# EAGLE board MainBoard (EAGLE 8.6.0)
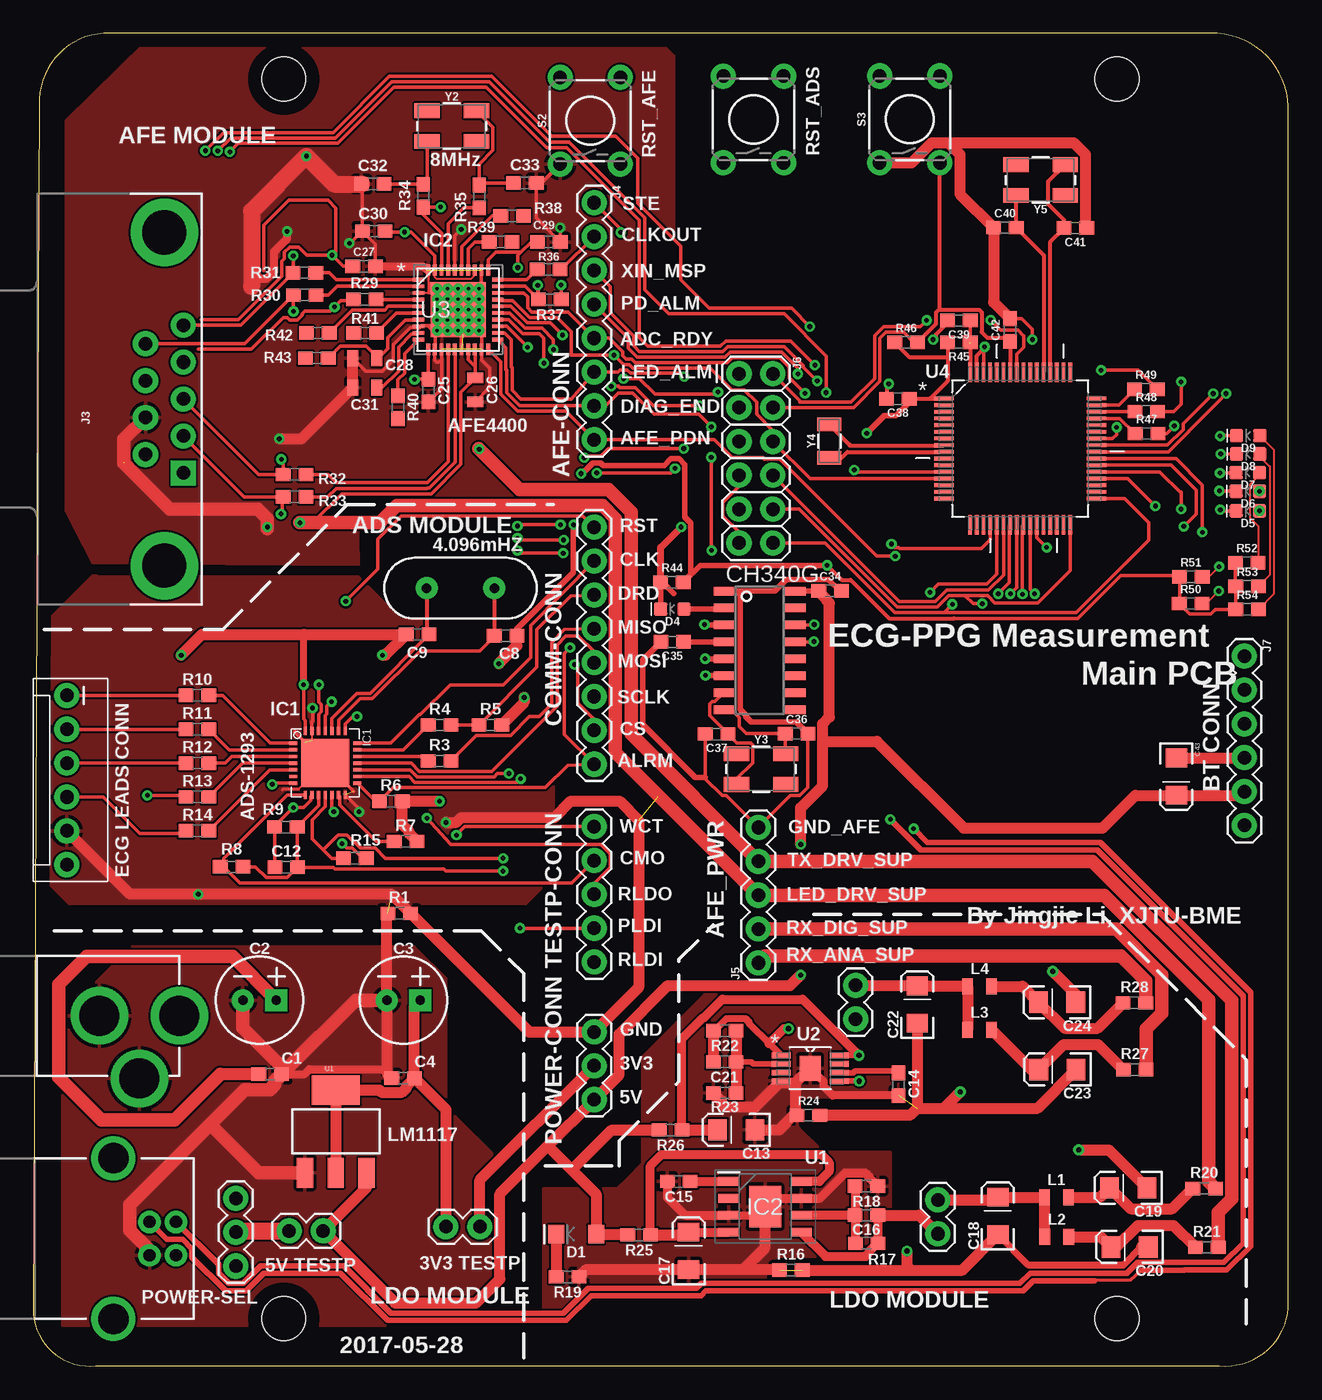
[diagram p2: board, top side]
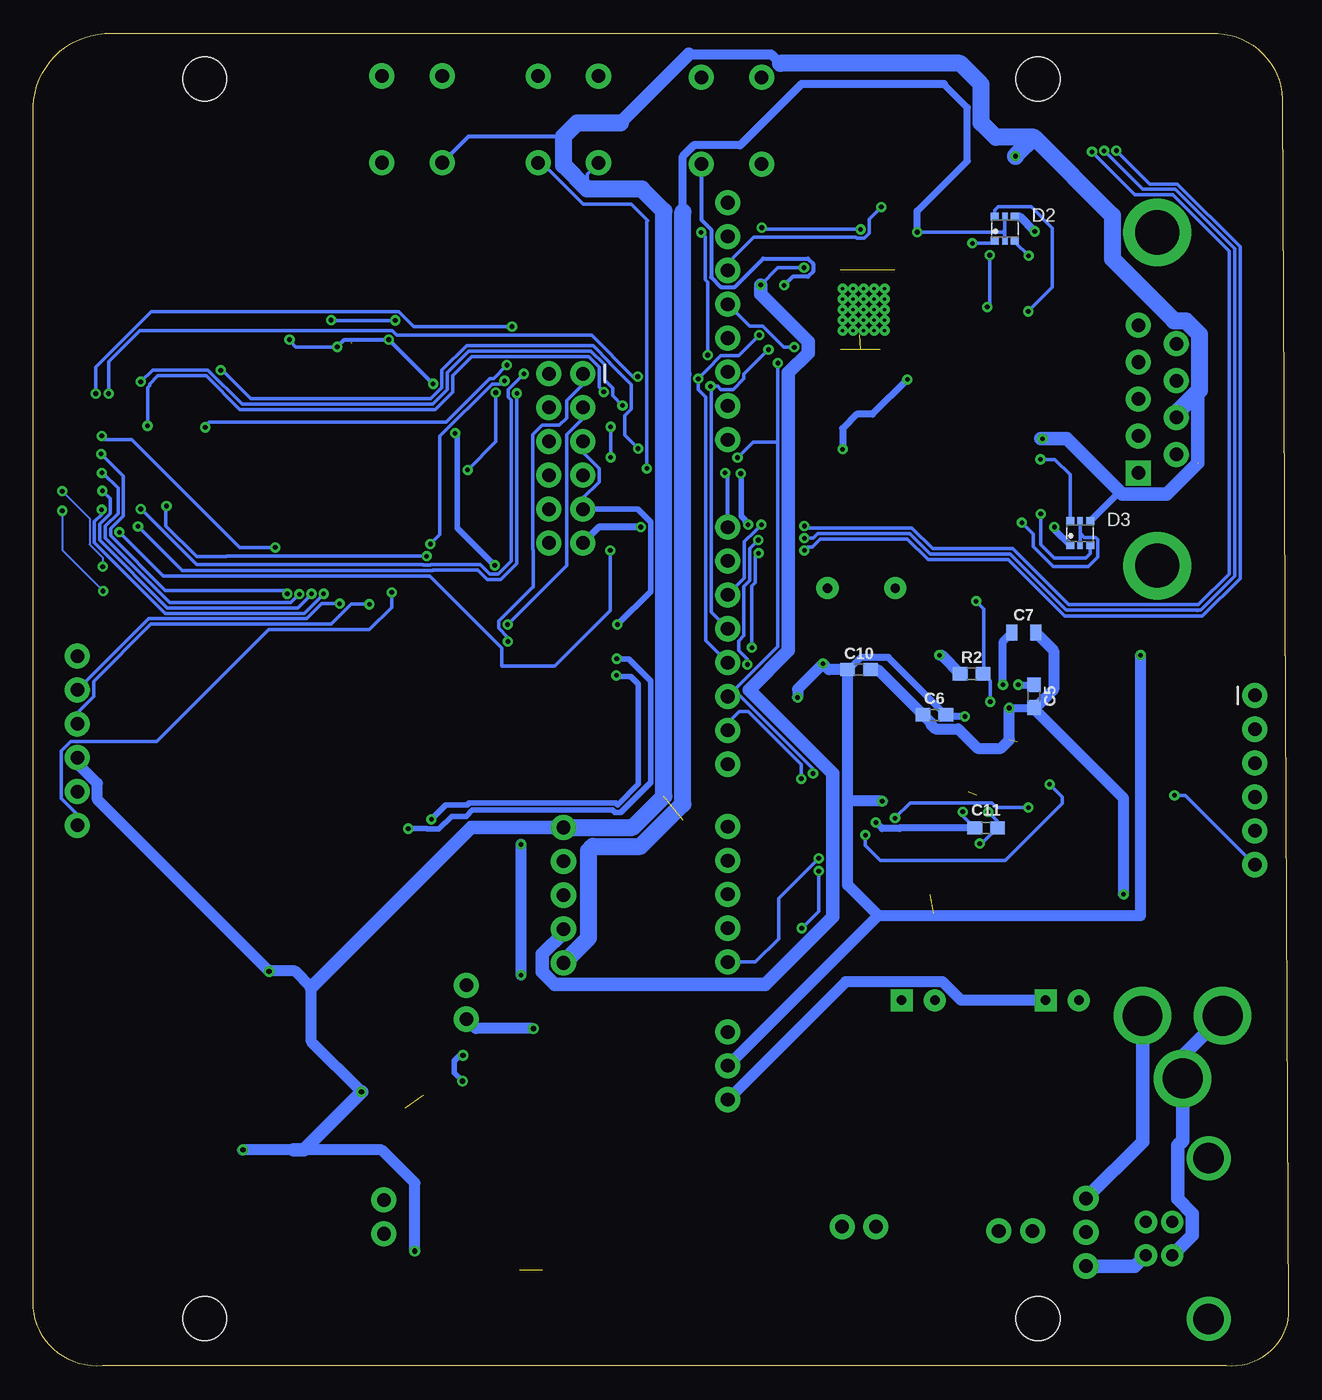
[diagram p3: board, bottom side, seen from below]

Size 94.11 x 99.97 mm. Coordinates in mm from the lower left corner, seen from the top.
Outline: 4.67,0.02 88.92,0.02 arc90 94.11,4.37 94.11,94.48 arc90 88.24,99.97 5.77,99.97 arc90 0.46,95.07 0,3.87 arc90 4.67,0.02
Copper layers (1*16): Top 0.035mm / dielectric 1.5mm / Bottom 0.035mm
Design rules "default": minimum track width 6mil, minimum drill 0.35mm, track to track 6mil, track to pad 6mil, pad to pad 6mil, via to via 6mil, smd to smd 6mil, copper to edge 40mil, drill to drill 6mil, minimum pad ring 10mil, minimum via ring 8mil, stop-mask expansion 4mil, vias tented up to drill 0mil, thermal gap 10mil

## Footprints (pad centres in the part's own frame; a part is rotated, then mirrored left to right if it is on the bottom)
1X02 = drill 1.016 pad 1.88: 1 0,0; 2 2.54,0
0603 = smd 1.1 x 1: 1 -0.85,0; 2 0.85,0
CPOL-RADIAL-2.5MM-6.5MM = drill 0.7 pad 1.651 square: 1 1.25,0 | drill 0.7 pad 1.651: 2 -1.25,0
0805 = smd 0.8 x 1.2: 1 -0.9,0; 2 0.9,0
EIA3216 = smd 1.4 x 1.6: A 1.4,0; C -1.4,0
1X08 = drill 1.016 pad 1.88: 1 0,0; 2 2.54,0; 3 5.08,0; 4 7.62,0; 5 10.16,0; 6 12.7,0; 7 15.24,0; 8 17.78,0
LED-1206 = smd 1.2 x 1.4: A -1.5,0; C 1.5,0
SOT363 = smd 0.6 x 0.6: 1 -0.75,-0.9; 3 0.75,-0.9; 4 0.75,0.9; 6 -0.75,0.9 | smd 0.4 x 0.6: 2 0,-0.9; 5 0,0.9
LED-0603 = smd 1 x 1: A -0.877,0; C 0.877,0
QFN28-5X5 = smd 0.25 x 0.6: 1 -1.5,-2.4; 2 -1,-2.4; 3 -0.5,-2.4; 4 0,-2.4; 5 0.5,-2.4; 6 1,-2.4; 7 1.5,-2.4; 15 1.5,2.4; 16 1,2.4; 17 0.5,2.4; 18 0,2.4; 19 -0.5,2.4; 20 -1,2.4; 21 -1.5,2.4 | smd 0.6 x 0.25: 8 2.4,-1.5; 9 2.4,-1; 10 2.4,-0.5; 11 2.4,0; 12 2.4,0.5; 13 2.4,1; 14 2.4,1.5; 22 -2.4,1.5; 23 -2.4,1; 24 -2.4,0.5; 25 -2.4,0; 26 -2.4,-0.5; 27 -2.4,-1; 28 -2.4,-1.5 | smd 3.6 x 3.6: GND 0,0
SOIC127P602X168-9N = smd 1.55 x 0.65: 1 -2.725,1.905; 2 -2.725,0.635; 3 -2.725,-0.635; 4 -2.725,-1.905; 5 2.725,-1.905; 6 2.725,-0.635; 7 2.725,0.635; 8 2.725,1.905 | smd 2.41 x 3.1: 9 0,0
POWER_JACK_PTH = drill 2.997 pad 4.318: GND 0,7.7; GNDBREAK 4.7,10.7; PWR 0,13.7
USB-B-PTH = drill 0.914 pad 1.676: D+ 4,1.25; D- 5.981,1.25; GND 4,-1.25; VBUS 5.981,-1.25 | drill 2.286: SHLD1 1.282,-6.02; SHLD2 1.282,6.02
DB9 = drill 1.016 pad 1.88 square: 1 -5.54,-1.42 | drill 1.016 pad 1.88: 2 -2.77,-1.42; 3 0,-1.42; 4 2.77,-1.42; 5 5.54,-1.42; 6 -4.15,1.42; 7 -1.38,1.42; 8 1.38,1.42; 9 4.15,1.42 | drill 3.302 pad 5.08: G1 -12.5,0; G2 12.5,0
1X05 = drill 1.016 pad 1.88: 1 0,0; 2 2.54,0; 3 5.08,0; 4 7.62,0; 5 10.16,0
2X6 = drill 1.016 pad 1.88: 1 0,0; 2 0,2.54; 3 2.54,0; 4 2.54,2.54; 5 5.08,0; 6 5.08,2.54; 7 7.62,0; 8 7.62,2.54; 9 10.16,0; 10 10.16,2.54; 11 12.7,0; 12 12.7,2.54
1X06 = drill 1.016 pad 1.88: 1 0,0; 2 2.54,0; 3 5.08,0; 4 7.62,0; 5 10.16,0; 6 12.7,0
1X03 = drill 1.016 pad 1.88: 1 0,0; 2 2.54,0; 3 5.08,0
TACTILE_SWITCH_PTH_6.0MM = drill 1.016 pad 1.88: 1 -3.251,2.261; 2 3.251,2.261; 3 -3.251,-2.261; 4 3.251,-2.261
MOLEX-1X6 = drill 1.016 pad 1.88: 1 0,0; 2 2.54,0; 3 5.08,0; 4 7.62,0; 5 10.16,0; 6 12.7,0
SOT223 = smd 1.219 x 2.235: 1 -2.311,-3.099; 2 0,-3.099; 3 2.311,-3.099 | smd 3.6 x 2.2: 4 0,3.099
SOP65P490X110-9N = smd 1.422 x 0.432: 1 -2.184,0.965; 2 -2.184,0.33; 3 -2.184,-0.33; 4 -2.184,-0.965; 5 2.184,-0.965; 6 2.184,-0.33; 7 2.184,0.33; 8 2.184,0.965 | smd 1.575 x 1.88: 9 0,0
RHA40_4P15X4P15 = smd 0.838 x 0.279: 1 -2.975,2.25; 2 -2.975,1.75; 3 -2.975,1.25; 4 -2.975,0.75; 5 -2.975,0.25; 6 -2.975,-0.25; 7 -2.975,-0.75; 8 -2.975,-1.25; 9 -2.975,-1.75; 10 -2.975,-2.25; 21 2.975,-2.25; 22 2.975,-1.75; 23 2.975,-1.25; 24 2.975,-0.75; 25 2.975,-0.25; 26 2.975,0.25; 27 2.975,0.75; 28 2.975,1.25; 29 2.975,1.75; 30 2.975,2.25 | smd 0.279 x 0.838: 11 -2.251,-2.975; 12 -1.75,-2.975; 13 -1.25,-2.975; 14 -0.75,-2.975; 15 -0.25,-2.975; 16 0.25,-2.975; 17 0.75,-2.975; 18 1.25,-2.975; 19 1.75,-2.975; 20 2.251,-2.975; 31 2.251,2.975; 32 1.75,2.975; 33 1.25,2.975; 34 0.75,2.975; 35 0.25,2.975; 36 -0.25,2.975; 37 -0.75,2.975; 38 -1.25,2.975; 39 -1.75,2.975; 40 -2.251,2.975 | smd 4.14 x 4.14: 41 0,0 | drill 0.254: V -1.575,-1.575; V_1 -1.575,-0.787; V_2 -1.575,0; V_3 -1.575,0.787; V_4 -1.575,1.575; V_5 -0.787,-1.575; V_6 -0.787,-0.787; V_7 -0.787,0; V_8 -0.787,0.787; V_9 -0.787,1.575; V_10 0,-1.575; V_11 0,-0.787; V_12 0,0; V_13 0,0.787; V_14 0,1.575; V_15 0.787,-1.575; V_16 0.787,-0.787; V_17 0.787,0; V_18 0.787,0.787; V_19 0.787,1.575; V_20 1.575,-1.575; V_21 1.575,-0.787; V_22 1.575,0; V_23 1.575,0.787; V_24 1.575,1.575
QFP50P1200X1200X120-64N = smd 1.473 x 0.279: 1 -5.715,3.759; 2 -5.715,3.251; 3 -5.715,2.743; 4 -5.715,2.261; 5 -5.715,1.753; 6 -5.715,1.245; 7 -5.715,0.762; 8 -5.715,0.254; 9 -5.715,-0.254; 10 -5.715,-0.762; 11 -5.715,-1.245; 12 -5.715,-1.753; 13 -5.715,-2.261; 14 -5.715,-2.743; 15 -5.715,-3.251; 16 -5.715,-3.759; 33 5.715,-3.759; 34 5.715,-3.251; 35 5.715,-2.743; 36 5.715,-2.261; 37 5.715,-1.753; 38 5.715,-1.245; 39 5.715,-0.762; 40 5.715,-0.254; 41 5.715,0.254; 42 5.715,0.762; 43 5.715,1.245; 44 5.715,1.753; 45 5.715,2.261; 46 5.715,2.743; 47 5.715,3.251; 48 5.715,3.759 | smd 0.279 x 1.473: 17 -3.759,-5.715; 18 -3.251,-5.715; 19 -2.743,-5.715; 20 -2.261,-5.715; 21 -1.753,-5.715; 22 -1.245,-5.715; 23 -0.762,-5.715; 24 -0.254,-5.715; 25 0.254,-5.715; 26 0.762,-5.715; 27 1.245,-5.715; 28 1.753,-5.715; 29 2.261,-5.715; 30 2.743,-5.715; 31 3.251,-5.715; 32 3.759,-5.715; 49 3.759,5.715; 50 3.251,5.715; 51 2.743,5.715; 52 2.261,5.715; 53 1.753,5.715; 54 1.245,5.715; 55 0.762,5.715; 56 0.254,5.715; 57 -0.254,5.715; 58 -0.762,5.715; 59 -1.245,5.715; 60 -1.753,5.715; 61 -2.261,5.715; 62 -2.743,5.715; 63 -3.251,5.715; 64 -3.759,5.715
STAND-OFF = hole 3.302: 0,0
SOIC16 = smd 0.635 x 1.524: 1 -4.445,-2.695; 2 -3.175,-2.695; 3 -1.905,-2.695; 4 -0.635,-2.695; 5 0.635,-2.695; 6 1.905,-2.695; 7 3.175,-2.695; 8 4.445,-2.695; 9 4.445,2.695; 10 3.175,2.695; 11 1.905,2.695; 12 0.635,2.695; 13 -0.635,2.695; 14 -1.905,2.695; 15 -3.175,2.695; 16 -4.445,2.695
HC49US = drill 0.7 pad 1.651: 1 -2.54,0; 2 2.54,0
CRYSTAL-SMD-5X3.2-4PAD = smd 1.9 x 1.1: 1 -1.85,-1.15; 2 1.85,-1.15; 3 1.85,1.15; 4 -1.85,1.15
CRYSTAL-SMD-3.2X1.5MM = smd 1 x 1.8: P$1 -1.25,0; P$2 1.25,0

## Placement (x,y rotation side)
3V3-POWER-TESTPOINT  [1X02]  33.47,10.47 180 top
3V3-POWER-TESTPOINT1  [1X02]  67.82,12.47 270 top
3V3-POWER-TESTPOINT2  [1X02]  61.65,28.57 270 top
5V-POWER-TESTPOINT  [1X02]  21.73,10.15 180 top
C1  0.1uF  [0603]  17.76,21.9 0 top
C2  100uF  [CPOL-RADIAL-2.5MM-6.5MM]  16.96,27.45 0 top
C3  100uF  [CPOL-RADIAL-2.5MM-6.5MM]  27.76,27.45 0 top
C4  0.1uF  [0603]  27.73,21.61 180 top
C5  0.1uF  [0603]  19.09,50.25 270 bottom
C6  0.1uF  [0603]  26.55,48.85 180 bottom
C7  1.0uF  [0805]  19.85,55.01 0 bottom
C8  22pF  [0603]  35.41,54.79 0 top
C9  22pF  [0603]  28.81,54.88 180 top
C10  0.1uF  [0603]  32.2,52.25 0 bottom
C11  0.1uF  [0603]  22.68,40.37 180 bottom
C12  1nF  [0603]  18.96,37.42 0 top
C13  10uF  [EIA3216]  52.71,17.72 180 top
C14  10nF  [0603]  64.87,21.15 270 top
C15  10nF  [0603]  48.39,13.86 180 top
C16  1nF  [0603]  62.46,11.32 180 top
C17  10uF  [EIA3216]  49.13,8.66 90 top
C18  10uF  [EIA3216]  72.32,11.27 90 top
C19  10uF  [EIA3216]  82.09,13.38 180 top
C20  10uF  [EIA3216]  82.2,8.94 180 top
C21  10nF  [0603]  51.84,22.83 0 top
C22  10uF  [EIA3216]  66.27,27.12 90 top
C23  10uF  [EIA3216]  76.79,22.25 180 top
C24  10uF  [EIA3216]  76.76,27.3 180 top
C25  0.1uF  [0603]  29.62,73.17 270 top
C26  1.0uF  [0805]  33.12,73.22 270 top
C27  10nF  [0603]  24.79,82.49 0 top
C28  2.2uF  [0805]  24.84,75.61 0 top
C29  0.1uF  [0603]  38.66,84.32 0 top
C30  0.1uF  [0603]  25.53,85.14 180 top
C31  2.2uF  [0805]  24.84,73.4 180 top
C32  18pF  [0603]  25.45,88.67 0 top
C33  18pF  [0603]  36.86,88.74 0 top
C34  0.1uF  [0603]  59.74,58.16 0 top
C35  0.1uF  [0603]  47.91,54.33 180 top
C36  22pF  [0603]  57.23,47.44 0 top
C37  22pF  [0603]  51.23,47.42 180 top
C38  0.1uF  [0603]  64.82,72.56 180 top
C39  1.0uF  [0603]  69.39,78.43 180 top
C40  30pF  [0603]  72.85,85.39 0 top
C41  30pF  [0603]  78.13,85.36 180 top
C42  0.1uF  [0603]  73.23,77.72 90 top
C43  10uF  [EIA3216]  85.7,44.22 270 top
COMM-CONN  [1X08]  42.05,62.93 270 top
D1  GREEN  [LED-1206]  40.69,9.9 180 top
D2  BAV99S  [SOT363]  21.26,85.31 0 bottom
D3  BAV99S  [SOT363]  15.62,62.48 0 bottom
D4  RED  [LED-0603]  47.91,56.79 180 top
D5  RED  [LED-0603]  91.06,64.16 180 top
D6  RED  [LED-0603]  91.06,65.63 180 top
D7  RED  [LED-0603]  91.06,67.03 180 top
D8  RED  [LED-0603]  91.09,68.42 180 top
D9  RED  [LED-0603]  91.09,69.79 180 top
IC1  ADS1293  [QFN28-5X5]  21.88,45.23 270 top
IC2  LP3878MR-ADJ_NOPB  [SOIC127P602X168-9N]  54.87,11.96 0 top
J1  POWER_JACK  [POWER_JACK_PTH]  -2.75,26.28 270 top
J2  USB_B_PTH  [USB-B-PTH]  4.71,9.57 0 top
J3  [DB9]  9.83,72.54 90 top
J4  [1X08]  42.05,87.27 270 top
J5  [1X05]  54.36,30.25 90 top
J6  2X6 FEMALE  [2X6]  52.91,74.44 270 top
J7  [1X06]  90.81,53.26 270 top
L1  3.3µH/±20%/450mA  [0805]  76.71,12.67 0 top
L2  3.3µH/±20%/450mA  [0805]  76.74,9.7 0 top
L3  3.3µH/±20%/450mA  [0805]  70.94,25.22 0 top
L4  3.3µH/±20%/450mA  [0805]  70.94,28.49 0 top
POWER-CONN  455-1750-1-ND  [1X03]  42.05,25.07 270 top
POWER-JUMPER  [1X03]  15.18,12.59 270 top
R1  0  [0603]  27.44,33.96 0 top
R2  1M  [0603]  23.76,51.93 180 bottom
R3  51  [0603]  30.46,45.39 0 top
R4  51  [0603]  30.46,48.09 0 top
R5  1M  [0603]  34.27,48.09 0 top
R6  1M  [0603]  26.81,42.37 0 top
R7  1M  [0603]  27.92,39.36 0 top
R8  10k  [0603]  14.87,37.45 180 top
R9  10M  [0603]  18.93,40.44 180 top
R10  0  [0603]  12.3,50.31 0 top
R11  0  [0603]  12.3,47.77 0 top
R12  0  [0603]  12.3,45.23 0 top
R13  0  [0603]  12.3,42.69 0 top
R14  0  [0603]  12.3,40.15 0 top
R15  0  [0603]  24.11,38.09 0 top
R16  0  [0603]  56.8,7.21 0 top
R17  2.55k  [0603]  62.49,9.22 0 top
R18  1k  [0603]  62.46,13.51 180 top
R19  4.7k  [0603]  40.06,6.7 180 top
R20  0  [0603]  87.78,13.33 0 top
R21  0  [0603]  87.99,8.91 0 top
R22  75k  [0603]  51.84,25.17 180 top
R23  47k  [0603]  51.84,20.49 0 top
R24  0  [0603]  58.12,18.82 0 top
R25  0  [0603]  45.42,9.85 180 top
R26  0  [0603]  47.78,17.72 180 top
R27  0  [0603]  82.58,22.25 0 top
R28  0  [0603]  82.55,27.25 0 top
R29  1k  [0603]  24.84,80 0 top
R30  0  [0603]  20.35,80.34 0 top
R31  0  [0603]  20.32,82.01 0 top
R32  0  [0603]  19.59,66.87 0 top
R33  0  [0603]  19.59,65.2 0 top
R34  0  [0603]  29.24,87.78 90 top
R35  0  [0603]  33.43,87.73 270 top
R36  10  [0603]  38.64,82.27 0 top
R37  10k  [0603]  38.74,80 180 top
R38  130  [0603]  35.89,86.28 0 top
R39  130  [0603]  35.03,84.32 0 top
R40  130  [0603]  27.33,71.93 270 top
R41  130  [0603]  24.87,77.49 180 top
R42  130  [0603]  21.34,77.49 180 top
R43  130  [0603]  21.26,75.61 180 top
R44  4.7k  [0603]  47.88,58.8 0 top
R45  1  [0603]  69.39,76.78 180 top
R46  10k  [0603]  65.43,76.78 0 top
R47  10  [0603]  83.47,69.95 0 top
R48  10  [0603]  83.44,71.6 0 top
R49  10  [0603]  83.42,73.27 0 top
R50  1k  [0603]  86.77,57.2 0 top
R51  1k  [0603]  86.79,59.2 0 top
R52  1k  [0603]  90.98,60.27 0 top
R53  1k  [0603]  91.01,58.49 0 top
R54  1k  [0603]  91.01,56.76 0 top
S1  MOMENTARY-SWITCH-SPST-PTH-6.0MM  [TACTILE_SWITCH_PTH_6.0MM]  54,93.51 90 top
S2  MOMENTARY-SWITCH-SPST-PTH-6.0MM  [TACTILE_SWITCH_PTH_6.0MM]  41.76,93.42 90 top
S3  MOMENTARY-SWITCH-SPST-PTH-6.0MM  [TACTILE_SWITCH_PTH_6.0MM]  65.71,93.52 90 top
SIGNAL-CONN  [MOLEX-1X6]  2.52,50.31 270 top
TEST-CONN  [1X05]  42.05,40.47 270 top
U1  [SOT223]  22.68,17.61 0 top
U2  TPS7A4901DGNR  [SOP65P490X110-9N]  58.24,22.35 0 top
U3  AFE4400_RHA_40  [RHA40_4P15X4P15]  31.85,79.24 0 top
U4  MSP430F149IPAG  [QFP50P1200X1200X120-64N]  73.99,68.83 0 top
U$1  [STAND-OFF]  81.26,3.58 0 top
U$2  [STAND-OFF]  81.26,96.54 0 top
U$3  [STAND-OFF]  18.77,96.54 0 top
U$4  [STAND-OFF]  18.77,3.58 0 top
U$5  CH340G  [SOIC16]  54.46,53.69 270 top
Y1  4.096MHz  [HC49US]  32.02,58.35 0 top
Y2  8MHz  [CRYSTAL-SMD-5X3.2-4PAD]  31.37,93.01 0 top
Y3  12MHz  [CRYSTAL-SMD-5X3.2-4PAD]  54.56,44.78 0 top
Y4  32.768kHz  [CRYSTAL-SMD-3.2X1.5MM]  59.69,69.39 90 top
Y5  8MHz  [CRYSTAL-SMD-5X3.2-4PAD]  75.52,88.97 180 top

## Tracks (layer width: path | path; a pad name or v marks a point on that pad's centre or on a via)
+3V3  (via drill 0.35, 0.35 pad 0.55)
  Top 0.254: IC1.28 20.38,48.42 20.26,48.53 v20.26,51.11 | IC1.22 23.38,48.16 23.95,48.73 v24.27,48.73 | R52.1 90.13,58.52 R53.1 R54.1 88.63,56.76 88.28,56.42 86.7,56.42 R50.1 85.94,57.22 R51.1 | 69.04,56.08 78.3,56.08 81.53,59.3 85.84,59.3
  Top 0.305: C38.1 65.7,72.59 67.24,72.59 | 67.24,72.59 U4.1 | R45.2 68.54,75.69 | 68.54,75.69 68.54,73.9 67.24,72.59 | 68.54,75.69 65.67,75.69 R46.1 | v59.51,60.07 60.61,58.97 61.27,58.97 64.16,56.08 69.04,56.08 | 85.84,59.3 R51.1
  Top 0.406: v41.07,66.95 41.15,66.95 41.94,67.73 42.55,67.73 42.72,67.56 47.3,67.56 47.81,68.06 48.41,68.06 48.84,67.63 48.84,63.69 49.3,63.24 49.3,59.36 R44.2 50,60.07 v59.51,60.07 | C8.2 36.26,55.3 40.49,59.53 40.49,63.09 v40.51,63.12 | v62.49,69.97 63.81,71.29 64.67,71.29 65.7,72.32 65.7,72.59
  Top 0.508: v20.26,51.11 20.26,54.85 20.3,54.88
  Top 0.813: 3V3-POWER-TESTPOINT.1 33.47,13.96 POWER-CONN.2 | v34.9,52.69 36.26,54.05 C8.2 | v36.81,50.15 36.81,49.78 R5.2 | v11.09,53.33 12.64,54.88 20.3,54.88 C9.2 26.4,53.33 v26.17,53.33 | R7.2 28.18,39.95 28.18,40.09 27.66,40.61 R6.2 v30.46,42.38
  Bottom 0.406: v40.51,63.12 40.75,63.35 40.75,63.47 41.04,63.76 41.04,66.92 v41.07,66.95 | v59.51,60.07 62.31,62.86 62.31,69.79 v62.49,69.97
  Bottom 0.508: v20.26,51.11 v20.26,51.1 C5.1 | v24.27,48.73 25.57,48.73 C6.1 30,53.16 32.07,53.16 32.98,52.25 C10.1
  Bottom 0.813: 24.54,52 R2.2 26,53.33 v26.17,53.33 | POWER-CONN.2 30.77,33.8 | 30.77,33.8 11.09,33.8 v11.09,53.33 | 30.77,33.8 33.05,36.08 33.05,42.38 | 33.05,42.38 C10.1 34.46,52.25 v34.9,52.69 36.81,50.79 v36.81,50.15 | v30.46,42.38 33.05,42.38
+5V  (via drill 0.35)
  Top 0.406: U$5.16 58.87,58.14 C34.1
  Top 0.61: 37.12,15.04 37.12,15.07
  Top 0.813: U1.3 24.99,13.41 5V-POWER-TESTPOINT.1 27.13,4.74 33.2,4.74 34.97,6.52 34.97,12.92 37.12,15.07 38.57,16.52 | 38.57,16.52 POWER-CONN.3 43.92,21.86 43.92,24.89 47.58,28.54 56.75,28.54 v57.53,29.33 | 38.57,16.52 40.38,14.71 | 40.38,14.71 42.19,12.9 D1.A 42.24,9.85 R25.2 | 40.38,14.71 43.39,17.72 R26.2 | v57.53,39.14 57.53,41.88 59.19,43.54 59.19,46.86 | 59.19,46.86 59.19,48.18 59.69,48.69 59.69,57.22 59.48,57.43 59.48,57.52 58.87,58.14 | J7.5 90.52,42.82 C43.A 82.63,42.82 80.16,40.36 69.75,40.36 63.25,46.86 59.19,46.86
  Top 0.889: C1.1 14,21.9
  Top 1.016: 14,21.9 10.59,18.49 5.08,18.49 1.91,21.66 1.91,28.62 4.02,30.73 14.94,30.73 C2.1
  Bottom 0.813: C2.1 24.55,27.45 25.93,28.84 33.2,28.84 POWER-CONN.3 | v57.53,29.33 v57.53,39.14
ADC_RDY  (via drill 0.35)
  Top 0.254: U3.28 36.78,80.49 37.06,80.21 37.06,79.39 37.38,79.07 40.09,79.07 J4.5 43.2,77.11 44.2,76.11 44.2,75.79 44.45,75.53 44.86,75.53 45.11,75.28 52.02,75.28 52.41,75.66 55.96,75.66 56.67,74.95 56.67,74.11 56.72,74.06 56.76,74.06 v57.86,72.97 | v86.26,62.99 87.2,63.93 87.2,65.7 85.32,67.58 U4.38
  Bottom 0.254: v57.86,72.97 57.86,65.66 57.86,65.65 57.86,60.21 59.08,59 60.06,59 60.77,59.71 64.16,59.71 64.18,59.69 82.96,59.69 v86.26,62.99
AFE_PDN  (via drill 0.35)
  Top 0.254: U3.20 35.03,75.34 35.03,72.9 36.31,71.62 39.91,71.62 J4.8 | J4.8 42.55,69.49 | J4.8 51.06,69.49 52.41,68.14 54.71,68.14 54.82,68.04 55.96,68.04 63.24,60.75 v64.62,60.75 | v84.13,64.51 82.07,66.57 U4.36
  Bottom 0.254: v64.62,60.75 79.61,60.75 79.63,60.73 81.88,60.73 84.17,63.02 84.17,64.47 v84.13,64.51
ALARMB  (via drill 0.35)
  Top 0.254: IC1.15 25.64,42.38 R6.1 26.97,43.39 38.4,43.39 40.08,45.07 COMM-CONN.8 39.8,47.39 39.8,53.46 v40.24,53.89 | v39.73,60.98 36.51,60.98 v36.3,61.19 | v12.9,91.16 14.27,92.53 22.47,92.53 26.69,96.74 34.36,96.74 38.85,92.25 43.66,92.25 45.32,90.59 45.32,87.22 48.54,84 48.54,81.48 50.67,79.34 56.85,79.34 v58.22,77.98 | v89.44,72.94 86.61,70.12 86.61,70.09 85.1,68.58 U4.40
  Bottom 0.254: v40.24,53.89 40.24,58.51 39.98,58.76 39.98,60.73 v39.73,60.98 | v36.3,61.19 36.05,61.44 35.72,61.44 35.11,62.05 28.57,62.05 27.02,60.5 21.01,60.5 16.77,56.26 6.47,56.26 3.63,59.09 3.63,83.98 8.33,88.67 10.41,88.67 v12.9,91.16 | v58.22,77.98 65.58,77.98 66.72,79.11 85.26,79.11 89.44,74.94 v89.44,72.94
CLK
  Top 0.254: IC1.21 26.8,46.73 28.94,48.87 29.01,48.87 31.25,51.11 35.22,51.11 37.28,53.17 37.28,55.55 COMM-CONN.2
CLKOUT_AFE
  Top 0.254: J4.2 39.58,82.27 R36.2
CMOUT
  Top 0.254: TEST-CONN.2 40.35,36.24 15.49,36.24 14.27,37.45 R8.2 14.27,37.71 14.27,38.07 19.03,42.83 IC1.8
D+  (via drill 0.35)
  Top 0.254: 79.58,6.41 79.62,6.45 82.3,6.47 83.06,7.21
  Top 0.406: J2.D+ 10.02,9.51 11.19,9.51 11.89,8.82 11.89,8.18 14.42,5.65 15.95,5.65 17.28,6.98 23.03,6.98 26.58,3.42 39.97,3.42 41.84,5.29 50.07,5.29 50.43,5.64 74.21,5.64 74.97,6.41 79.58,6.41 | 83.06,7.21 86.31,7.21 86.32,7.22 89.49,7.22 91.27,9 91.27,28.02 80,39.29 67.03,39.29 v66,40.32 | v50.37,53.06 U$5.5
  Bottom 0.406: v66,40.32 64.6,40.32 64.57,40.28 63.7,40.28 62.74,41.24 61.65,41.24 61.19,41.7 50.68,41.7 50.53,41.55 50.06,41.55 47.83,43.78 47.83,51.4 49.48,53.06 v50.37,53.06
D-  (via drill 0.35)
  Top 0.406: J2.D- 13.89,7.63 13.89,6.97 14.65,6.21 15.72,6.21 17.05,7.54 23.26,7.54 26.81,3.98 39.74,3.98 41.6,5.85 49.72,5.85 50.07,6.2 73.97,6.2 74.74,6.97 81.98,6.97 82.79,7.78 89.26,7.78 90.71,9.23 90.71,27.79 79.76,38.73 66.55,38.73 v64.26,41.02 | 51.71,51.84 U$5.6 51.74,51.81 v50.4,51.81
  Bottom 0.406: v64.26,41.02 63.17,42.11 61.58,42.11 61.42,42.26 50.45,42.26 50.29,42.11 48.74,43.66 48.74,51.15 49.33,51.73 50.32,51.73 v50.4,51.81
DIAG_END  (via drill 0.35)
  Top 0.254: U3.21 35.43,76.39 35.43,74.76 35.48,74.71 35.48,73.02 36.48,72.03 J4.7 42.9,72.03 43.87,73 44.96,73 46.56,71.4 49.88,71.4 v50.83,70.45 | v50.83,68.17 50.83,61.21 v50.85,61.18 | v87.66,62.56 87.66,66.09 85.68,68.07 U4.39
  Bottom 0.254: v50.83,70.45 v50.83,68.17 | v50.85,61.18 50.85,56.69 55.02,52.52 58.98,52.52 58.98,53.87 64.39,59.28 84.38,59.28 v87.66,62.56
DRDYB  (via drill 0.35)
  Top 0.254: R4.2 R5.1 37.76,52.43 37.76,55.23 40.3,57.77 COMM-CONN.3 | v39.52,63.12 36.41,63.12 v36.3,63.01 | v14.73,91.08 15.37,91.71 22.81,91.71 27.03,95.93 33.96,95.93 38.51,91.38 40,91.38 45.41,85.97 45.41,77.13 46.05,76.5 51.52,76.5 51.9,76.88 56.8,76.88 v58.6,75.08 | v81.22,70.42 81.22,69.88 80.9,69.57 80.88,69.59 U4.42
  Bottom 0.254: COMM-CONN.3 40.79,59.1 40.79,61.85 40.03,62.62 v39.52,63.12 | v36.3,63.01 36.15,62.86 28.23,62.86 26.68,61.31 20.68,61.31 16.49,57.12 6.76,57.12 4.45,59.43 4.45,83.64 8.66,87.86 11.51,87.86 v14.73,91.08 | v58.6,75.08 59.6,74.08 59.88,74.08 63.14,70.83 80.91,70.83 81.21,70.53 81.21,70.43 v81.22,70.42
DTR  (via drill 0.35)
  Top 0.254: U$5.13 58.5,54.33 v58.52,54.35
  Bottom 0.254: v58.52,54.35 58.52,54.67 59.21,55.35 59.21,55.9 56.67,58.44 56.64,58.44 56.64,61.21 56.67,61.24 56.67,69.87 55.96,70.58 54.67,70.58 54.13,71.12 54.13,72.41 52.91,73.63 J6.1
EN_BT  (via drill 0.35)
  Top 0.254: U4.21 72.24,59.42 71.48,58.66 67.87,58.66 v67.24,58.03
  Bottom 0.254: J7.6 90.81,41.37 92.03,42.59 92.03,46.14 91.31,46.86 84.86,46.86 76.48,55.25 68.91,55.25 67.24,56.92 v67.24,58.03
GND  (via drill 0.35, 0.35 pad 0.55, 0.4)  (13 unrouted)
  Top 0.152: U3.40 29.6,80.52 29.57,80.49 U3.3 | U3.8 29.52,77.99 30.1,77.41 U3.12
  Top 0.203: 18.67,43.23 18.72,43.28 19.89,43.28 20.35,43.73 20.35,46.81
  Top 0.254: IC1.27 20.88,48.36 20.93,48.41 v20.93,49.36 | IC1.14 24.42,41.79 v24.42,41.58 | 19.59,47.62 19.59,47.57 20.35,46.81 | 24,43.12 23.5,43.63 23.47,43.63 | C30.2 25.64,84.17 C27.2 | C32.1 24.68,88.59 C30.2 | U3.8 28.8,77.91 28.27,77.91 26.98,76.62 26.98,75.45 26.17,74.65 24.91,74.65 C28.1 | U3.12 30.1,75.46 30.25,75.31 30.41,75.31 30.6,75.5 | 30.6,75.5 U3.13 | 30.6,75.5 30.6,73.31 C25.2 | U3.41 31.85,77.72 32.18,77.39 | U3.36 31.6,84.78 v32.08,85.26 | C33.2 37.71,86.13 C29.2 39.51,85.38 v39.5,85.39 | U3.19 33.6,75.46 34.22,74.85 34.22,73.42 C26.2 | C30.2 23.76,84.22 v23.7,84.22 | C36.2 58.08,43.4 57.48,42.8 56.75,42.8 J5.5 51.97,42.8 51.65,42.8 50.38,44.06 50.38,44.17 C37.2 | v71.33,76.45 71.25,76.38 U4.62 | v74.9,77 74.9,77.77 74.11,78.57 C42.2
  Top 0.305: S2.1 38.08,88.74 C33.2 | v71.33,76.45 71.1,76.23 71.1,76.15 70.74,75.79 U4.63 | v67.46,77 67.69,77.22 67.69,77.41 68.54,78.26 C39.2 | v64.14,73.68 63.97,73.52 C38.2
  Top 0.406: U2.4 55.92,21.24 | C35.2 45.68,52.95 45.68,48.13 49.64,44.17 50.38,44.17 | C36.2 57.21,48.31 53.82,48.31 53.42,48.71 53.42,48.84 53.01,49.24 53.01,57.88 52.76,58.14 | 52.76,58.14 U$5.1 | 52.76,58.14 55.57,58.14 56.45,59.02 59.59,59.02 60.45,58.16 C34.2
  Top 0.508: 83.09,8.94 81.73,7.58 74.61,7.58 C18.C
  Top 0.61: IC2.3 54.84,11.32 54.87,11.3 | U2.9 59.26,21.33 59.26,20.98 59.93,20.3 C14.2 | 16.36,80.97 16.97,81.58 17.52,81.58 18.06,82.12 18.06,83.61 19.03,84.58 v19.03,85.11 19.03,85.14 | C27.2 29.23,82.49 29.51,82.22 | C1.2 20.32,21.9 20.69,22.27 26.22,22.27 C4.2
  Top 0.66: C15.2 47.54,12.66 48.87,11.32 IC2.3 | IC2.9 55.5,12.59 IC2.7 58.96,12.59 60.86,14.49 62.36,14.49 62.64,14.21 62.64,14.18 R18.1
  Top 0.813: C4.2 26.51,21.98 C3.2 26.51,33.88 R1.1 | SIGNAL-CONN.5 7.28,35.39 v12.36,35.39 26.86,35.39 R1.2 37.18,25.07 POWER-CONN.1 45.38,28.41 45.38,40.95 43.95,42.38 40.3,42.38 39.08,41.16 32.08,41.16 31.71,40.79 v30.93,40.79 | R19.1 41.46,7.26 C17.C 53.24,7.26 | IC2.9 54.87,11.3 54.87,8.89 53.24,7.26 | 53.24,7.26 55.9,7.26 R16.1 | R16.2 65.81,7.21 | 65.81,7.21 69.65,7.21 C18.C | 65.81,7.21 65.51,7.51 v65.51,8.63 | 83.6,13.28 C19.C 80.65,16.23 v78.39,16.23 | C20.C 83.09,8.94 | R23.1 51.58,19.9 51.58,19.76 51.91,19.43 54.11,19.43 55.92,21.24 57.14,21.24 | 57.14,21.24 U2.9 | 57.14,21.24 57.14,18.94 | 57.14,18.94 R24.1 | C13.C 55.92,17.72 57.14,18.94 | C22.C 66.27,19.35 | R24.2 65.74,18.82 66.27,19.35 | 66.27,19.35 68.28,19.35 | 68.28,19.35 75.29,19.35 C23.C | 68.28,19.35 v69.5,20.57 69.52,20.59 | v76.43,29.61 78.16,27.88 C24.C | v18.44,69.57 20.11,69.57 C31.2 C28.1 | 68.59,91.77 67.35,91.77 65.85,90.27 S3.1 | 68.59,91.77 69.47,90.89 69.47,87.92 C40.1 72,79.8 C42.2 | C41.1 78.87,85.47 78.87,90.9 78.01,91.77 68.59,91.77 | C43.C 90.78,45.62 J7.4
  Top 1.016: U1.1 16.89,14.51 13.25,18.15 | 13.25,18.15 15.84,20.74 17.73,20.74 18.12,21.12 18.12,21.41 C1.2 18.9,22.19 | 18.9,22.19 24.16,27.45 C3.2 | 18.9,22.19 15.71,25.37 C2.2 | J3.7 6.78,69.53 6.78,67.74 10.24,64.28 16.82,64.28 17.53,63.57 17.53,63.5 17.55,63.47 v17.55,62.94 17.55,62.83 | J2.GND 8.71,8.7 7.22,10.2 7.22,12.12 13.25,18.15
  Top 1.27: C32.1 22.56,88.67 v20.47,90.75 16.36,86.63 16.36,80.97
  Bottom 0.254: v24.42,41.58 24.42,41.27 C11.2 | v39.5,85.39 39.37,85.26 v32.08,85.26 | v23.7,84.22 22.2,84.22 D2.1 | S1.1 52.58,89.41 52.58,88.29 | v71.33,76.45 74.43,76.45 74.8,76.83 74.8,76.9 v74.9,77
  Bottom 0.305: S3.1 61.47,92.25 54.36,92.25 | v71.33,76.45 70.78,77 v67.46,77 64.15,73.68 v64.14,73.68
  Bottom 0.508: 20.93,49.52 v20.93,49.36 | C11.2 29.12,40.37 29.18,40.32 30.47,40.32 v30.93,40.79 | 12.47,65.4 12.85,65.4 D3.4 | v17.55,62.94 17.55,62.76 D3.1
  Bottom 0.61: v20.93,49.36 19.13,49.36 C5.2 | v19.03,85.11 20.13,86.21 D2.4
  Bottom 0.762: 38.1,97.71 38.78,98.39 44.96,98.39
  Bottom 0.813: v12.36,35.39 12.36,42.59 19.13,49.36 18.99,49.36 17.6,50.74 17.6,53.66 C7.2 | C10.2 30.8,52.25 C6.2 26.81,48.26 26.81,48.12 26.48,47.79 24.76,47.79 23.31,46.34 21.57,46.34 20.93,46.98 v20.93,49.36 | v65.51,8.63 65.51,13.74 68,16.23 74.58,16.23 v78.39,16.23 78.41,16.23 | v69.5,20.57 73.26,24.33 73.26,28.42 74.47,29.64 76.41,29.64 v76.43,29.61 89.31,42.49 89.31,43.72 90.81,45.22 J7.4
  Bottom 1.016: 73.26,28.42 61.27,40.41 J5.5 | v69.5,20.57 73.84,16.23 74.58,16.23 | 50.09,93.26 44.96,98.39 | 18.57,69.57 v18.44,69.57 16.63,69.57 12.47,65.4 9.14,65.4 6.81,67.72 6.81,72.76 | J1.GND 7.95,23.28 J1.GNDBREAK 7.95,16.91 8.31,16.55 8.31,12.53 7.22,11.44 7.22,9.82 J2.GND
  Bottom 1.27: 50.09,93.26 53.34,93.26 54.36,92.25 54.36,90.06 52.58,88.29 48.49,88.29 46.84,86.63 46.84,42.74 49.18,40.41 J5.5 | 38.1,97.71 24.61,97.71 23.04,96.13 23.04,93.26 21.95,92.17 19.08,92.17 | 19.08,92.17 20.47,90.77 v20.47,90.75 | 19.08,92.17 13.21,86.3 13.21,83.05 8.57,78.41 7.7,78.41 6.68,77.4 6.68,73.2 8.41,71.47 J3.7
  pour Top: 8.38,99.31 47.04,99.31 48.06,98.29 48.06,67.81 46.05,65.81 39.65,65.81 38.2,64.36 24.31,64.36 24.39,60.07 4.45,60.22 2.44,64.13 2.44,93.47
  pour Top: 4.68,59.2 24.36,59.2 24.92,58.64 27.56,56 38.97,56 38.97,36.77 36.91,34.72 2.69,34.72 1.58,35.83 1.02,36.39 1.02,55.82 4.47,59.28 4.75,59.28
  pour Top: 38.28,3.27 38.28,13.3 43.79,13.3 44.55,14.07 45.7,15.21 45.7,19.76 45.7,23.19 51.26,28.75 61.9,28.75 63.91,26.74 63.91,23.26 64.82,22.35 64.82,20.21 57.46,20.21 57.33,20.34 57.33,17.9 59.21,16.02 64.24,16.02 64.24,8.33 64.31,8.25 55.86,8.25 54.87,7.67 54.87,4.52 53.57,3.22 38.28,3.22
  pour Top: 2.21,26.28 7.37,31.44 9.6,31.44 28.55,31.44 28.65,31.34 30.91,29.08 30.91,23.92 30.91,19.43 37.06,13.28 37.06,3.5 36.63,3.07 2.21,3.07
LA
  Top 0.254: SIGNAL-CONN.2 R11.1
LED_ALM  (via drill 0.35)
  Top 0.254: U3.22 35.33,77.49 35.84,76.98 35.84,74.93 35.89,74.88 35.89,73.19 36.54,72.55 40.32,72.55 J4.6 43.83,74.57 43.98,74.72 44.52,74.72 44.78,74.47 48.54,74.47 v48.79,74.22 | v88.47,72.94 86.21,70.68 86.21,70.26 85.03,69.08 U4.41
  Bottom 0.254: v48.79,74.22 49.15,74.22 52.25,77.32 66.86,77.32 67.19,77.65 86.15,77.65 88.47,75.33 v88.47,72.94
LED_DRV_SUP  (via drill 0.35)
  Top 0.254: U3.18 33.12,76.25 33.12,74.98 | 33.12,74.98 C26.1 32.06,73.06 32.06,67.65 29.83,65.43 23.12,65.43 20.96,63.27 v19.99,63.27 | U3.17 32.6,75.5 33.12,74.98
  Top 1.016: R20.2 88.14,13.82 88.14,27.48 80.29,35.33 J5.3 43.65,46.04 43.65,63.59 42.68,64.56 27.26,64.56 25.96,63.27 v19.99,63.27
  Bottom 0.254: D3.2 15.62,62.48 | 15.62,62.48 D3.5 | v19.99,63.27 19.15,62.43 19.15,61.46 17.65,59.96 15.01,59.96 14.29,60.68 14.29,61.99 14.46,62.16 15.3,62.16 15.62,62.48
LL
  Top 0.254: SIGNAL-CONN.3 R12.1
MISO  (via drill 0.35)
  Top 0.254: R3.2 33.23,47.31 35.78,47.31 37.2,48.73 37.92,48.73 38.87,49.68 38.87,54.28 39.82,55.23 COMM-CONN.4 | U3.25 35.73,78.99 36.88,77.85 38.15,77.85 38.99,77.01 v38.99,76.25 38.99,76.22 | v43.33,73.5 43.88,73.5 43.98,73.4 45.12,73.4 46.47,72.05 v49.94,72.05 | v86.06,73.83 86.06,72.16 85.5,71.6 R48.2
  Bottom 0.254: v38.99,76.25 40.83,74.41 40.83,74.06 41.64,73.25 42.55,73.25 42.8,73.5 v43.33,73.5 43.28,73.45 43.28,56.55 COMM-CONN.4 | v49.94,72.05 50.68,72.79 50.68,73.34 51.28,73.95 51.28,75.12 52.31,76.14 61.45,76.14 63.07,74.53 63.07,73.24 64.16,72.16 78.45,72.16 81.02,74.72 85.17,74.72 v86.06,73.83
MOSI  (via drill 0.35)
  Top 0.254: IC1.18 28.32,45.23 28.94,44.61 34.38,44.61 39.28,49.51 39.28,54.1 39.93,54.76 40.85,54.76 40.86,54.77 42.05,53.59 COMM-CONN.5 | U3.26 35.8,79.49 37.04,78.25 38.76,78.25 v39.68,77.34 39.7,77.31 | v44.25,74.06 45.44,74.06 46.61,72.89 51.16,72.89 v51.34,73.07 | v85.55,70.53 84.96,69.95 R47.2
  Bottom 0.254: v39.68,77.34 41.23,75.79 42.55,75.79 43.61,74.73 43.61,74.7 v44.25,74.06 44.25,73.25 43.69,72.68 43.69,54.41 COMM-CONN.5 | v51.34,73.07 51.69,73.43 51.69,74.95 52.48,75.74 61.24,75.74 62.67,74.31 62.67,73.07 63.99,71.75 78.62,71.75 81.16,74.29 84.79,74.29 85.4,73.68 85.4,73.56 85.55,73.41 v85.55,70.53
MSP_RESET
  Top 0.254: J6.4 61.5,71.9 63.48,73.89 63.48,77.12 63.92,77.56 65.25,77.56 66.03,76.78 R46.2
  Top 0.305: 67.87,79.24 67.69,79.06 67.69,78.19 R46.2 | 67.87,79.24 70.92,79.24 71.1,79.06 71.1,77.56 71.53,77.13 72.96,77.13 C42.1 U4.58 | 67.87,79.24 67.97,79.34 S3.3
N$1  (via drill 0.35 pad 0.55)
  Top 0.254: IC1.26 21.38,48.88 21.59,49.09 21.59,49.63 21.41,49.81 v21.41,51.11
  Bottom 0.61: C7.1 21.41,54.36 v21.41,51.11
N$2
  Bottom 1.016: J2.VBUS 11.51,7.51 POWER-JUMPER.3
N$3
  Bottom 1.016: J1.PWR 10.95,16.83 POWER-JUMPER.1
N$4
  Top 0.813: D1.C 39.19,6.72 R19.2
N$5
  Top 0.254: 34.74,54.97 C8.1 34.56,54.73 33.47,53.65 28.99,53.65 25.41,50.06 24.49,50.06 22.88,48.45 IC1.23
  Top 0.305: Y1.2 C8.1
N$6
  Top 0.254: IC1.24 22.38,48.59 24.27,50.47 25.24,50.47 C9.1
  Top 0.305: Y1.1 29.48,55.06 C9.1
N$7
  Top 0.254: IC1.19 29.27,45.73 R3.1
N$8
  Top 0.254: IC1.20 27.75,46.23 R4.1
N$9
  Top 0.254: IC1.13 22.98,42.74 22.98,42.1 25.72,39.36 R7.1
N$10  (via drill 0.35 pad 0.55)
  Top 0.254: IC1.12 22.38,41.72 v22.52,41.58 | v23.15,39.2 23.49,38.87 23.92,38.87 24.7,38.09 R15.2
  Bottom 0.254: v22.52,41.58 21.83,40.89 C11.1 23,39.2 v23.15,39.2
N$11
  Top 0.254: R10.2 14.2,50.31 17.78,46.73 IC1.1
N$12
  Top 0.254: R11.2 14.69,46.23 IC1.2
N$13
  Top 0.254: R12.2 14.39,45.23 14.89,45.73 IC1.3
N$14
  Top 0.254: R13.2 15.69,45.23 IC1.4
N$15
  Top 0.254: R14.2 17.73,44.73 IC1.5
N$16
  Top 1.27: POWER-JUMPER.2 15.29,10.15 5V-POWER-TESTPOINT.2
N$17
  Top 0.813: U1.2 U1.4 25.94,20.71 26.09,20.55 27.66,20.55 27.98,20.88 27.98,21.02 C4.1 | C4.1 28.58,27.02 C3.1 | C4.1 30.93,19.25 3V3-POWER-TESTPOINT.2
N$18
  Top 0.813: 3V3-POWER-TESTPOINT1.1 72.11,12.47 C18.A L1.1 75.81,9.72 L2.1
N$19
  Top 0.66: R18.2 C16.2 | C16.2 61.61,9.24 R17.1 | C16.2 IC2.6
N$20
  Top 0.66: C15.1 IC2.1
N$21
  Top 0.66: C16.1 63.31,9.24 | 63.31,9.24 R17.2 | 63.31,9.24 62.67,8.6 62.67,8.52 62.39,8.23 59.41,8.23 IC2.5
  Top 0.813: C16.1 66.42,11.32 3V3-POWER-TESTPOINT1.2
N$22
  Top 0.406: U2.6 61.49,22.02 61.61,22.14 64.74,22.14 C14.1
N$23
  Top 0.813: L1.2 79.98,12.67 C19.A 82.27,11.81 85.41,11.81 R20.1
N$24
  Top 0.813: L2.2 80.03,9.7 C20.A 81.21,8.94 82.83,10.56 85.49,10.56 R21.1
N$25  (via drill 0.4)
  Top 0.406: U2.5 v61.93,21.38 61.95,21.38 | U2.8 v61.9,23.31 61.95,23.31
  Top 0.66: R26.1 48.63,24.54 50.24,26.15 50.29,26.15 51.67,27.53 57.69,27.53 v61.9,23.31
  Top 0.813: R26.1 C13.A
  Bottom 0.406: v61.9,23.31 62.13,23.31 62.54,22.91 62.54,21.99 v61.93,21.38
N$26  (via drill 0.4)
  Top 0.508: R22.2 51.07,25.17 51.97,26.07 53.41,26.07 53.65,25.83 53.65,25.72 55.17,24.2 U2.1
  Top 0.66: 55.17,24.2 56.29,25.32 v56.62,25.32 56.69,25.32
  Top 0.813: R22.2 C21.1
  Bottom 0.813: v56.62,25.32 60.94,25.32 3V3-POWER-TESTPOINT2.2
N$27
  Top 0.406: C21.2 53.82,22.83 53.98,22.68 U2.2
  Top 0.813: R22.1 C21.2 R23.2
N$28
  Top 0.813: L3.2 74.82,22.25 C23.A 77.27,24.13 79.81,24.13 81.69,22.25 R27.1
N$29
  Top 0.66: C17.A IC2.4 | R25.1 46.27,15.02 47.12,15.87 59.08,15.87 59.67,15.29 59.67,14.6 58.93,13.86 IC2.8
  Top 0.813: C17.A 49.1,9.85 R25.1
  Top 1.016: C17.A 48.92,9.85
N$30
  Top 0.813: L4.2 74.17,28.49 C24.A 77.32,25.34 79.8,25.34 R28.1
N$31
  Top 0.254: U3.7 28.84,78.46 27.89,78.46 26.57,77.13 26.57,76.32 25.86,75.61 | 25.86,75.61 C28.2 | R43.1 23.03,76.53 24.94,76.53 25.86,75.61
N$32
  Top 0.254: U3.9 28.8,77.41 28.34,77.41 27.38,76.45 27.38,74.65 26.14,73.4 C31.1
N$33
  Top 0.254: R32.2 22.1,66.87 22.71,66.26 29.52,66.26 31.1,67.85 U3.14
N$34
  Top 0.254: U3.4 28.87,80.01 R29.2
N$35
  Top 0.254: 33.58,82.16 33.58,81.3 33.48,81.2
N$36
  Top 0.254: U3.1 22.72,81.49 22.2,82.01 R31.2
N$37
  Top 0.254: U3.2 22.79,80.99 22.79,81 22.13,80.34 R30.2
N$38  (via drill 0.35)
  Top 0.254: v19.48,83.28 19.47,83.27 R31.1 15.54,78.08 J3.5
  Bottom 0.254: v19.48,83.28 20.51,84.31 D2.3
N$39  (via drill 0.35)
  Top 0.254: v19.51,79.12 19.5,79.13 R30.1 15.85,76.69 J3.9
  Bottom 0.254: v19.51,79.12 17.71,80.92 17.71,85.36 19.31,86.96 21.74,86.96 22.01,86.7 D2.6
N$40
  Top 0.254: R33.2 20.46,65.17 22.05,65.17 22.71,65.83 29.49,65.83 29.52,65.86 29.69,65.86 31.65,67.82 31.65,76.22 U3.15
N$41  (via drill 0.35)
  Top 0.254: J3.3 16.92,66.87 R32.1 18.74,67.88 v18.59,68.02 18.54,68.07
  Bottom 0.254: v18.59,68.02 17.53,68.02 16.37,66.86 D3.6
N$42  (via drill 0.35)
  Top 0.254: J3.2 15.82,65.2 R33.1 18.67,65.13 18.67,64.03 v18.57,63.93
  Bottom 0.254: v18.57,63.93 18.57,61.62 17.55,60.6 15.22,60.6 14.87,60.94 D3.3
N$43
  Top 0.254: Y2.1 29.52,88.91 R34.2 29.2,88.67 C32.2
N$44
  Top 0.254: Y2.3 34.45,92.93 34.45,91.19 33.43,90.17 R35.1 33.59,88.74 C33.1
N$45
  Top 0.254: U3.30 37.01,81.49 R36.1
N$46  (via drill 0.35)
  Top 0.254: U3.29 36.9,80.99 R37.2
  Top 0.305: v37.82,81.07 37.82,80.07 R37.2
  Bottom 0.305: v37.82,81.07 37.18,81.71 36.04,81.71 35.64,82.11 35.64,82.68 36.04,83.08 39.4,83.08 41.53,80.94 42.56,80.94 43.29,81.67 43.29,85.25 44.02,85.98 S2.3
N$47
  Top 0.254: 32.08,76.3 32.08,77.72
N$48
  Top 0.254: U3.37 31.1,85.71 32.27,86.88 R35.2
N$49
  Top 0.254: U3.35 32.1,83.96 34.42,86.28 R38.1
N$50
  Top 0.254: R42.1 23.92,79.23 26.36,79.23 26.63,79.49 U3.5
N$51
  Top 0.254: 33.61,76.25 33.61,77.82
N$52
  Top 0.254: R41.1 27.22,78.99 U3.6
N$53
  Top 0.254: U3.10 27.84,75.95 27.84,74.49 27.33,73.99 R40.1
N$54
  Top 0.254: U3.34 32.6,83.83 33.1,84.32 R39.1
N$60
  Top 0.254: 30.13,76.17 30.13,77.82
N$61
  Top 0.254: 28.93,77.87 29.11,78.05 29.82,78.05
N$62
  Top 0.152: 29.57,80.49 30.02,80.49
N$63
  Top 0.152: 29.72,80.51 29.72,81.28
N$64
  Top 0.152: 20.88,47.59 20.88,46.78
N$65  (1 unrouted)
  Top 0.254: C39.1 70.24,76.73
  Top 0.305: 70.24,76.73 70.24,74.56 U4.64
N$66
  Top 0.254: U4.45 81.47,71.09 R47.1
N$67
  Top 0.406: C35.1 U$5.4
N$68
  Top 0.406: D4.A 51.69,56.79 U$5.2
N$69
  Top 0.305: Y4.P$2 61.19,69.14 61.19,69.06 68.25,69.06 U4.8
N$70
  Top 0.305: Y5.3 73.67,85.42 C40.2 75.74,83.34 U4.53
N$71
  Top 0.254: U4.46 79.73,71.6 R48.1
N$72
  Top 0.254: U4.47 81.37,72.08 R49.1
N$73  (via drill 0.35)
  Top 0.254: U4.23 73.17,63.05 73.17,58.78 72.6,58.2 72.6,58.18 v72.35,57.93 | v88.99,64.24 89.07,64.16 D5.C
  Bottom 0.254: v72.35,57.93 72.6,57.68 72.6,57.66 73.79,56.46 84.22,56.46 89.53,61.78 89.53,63.33 88.99,63.88 v88.99,64.24
N$74  (via drill 0.35)
  Top 0.254: U4.24 73.74,58.42 v73.25,57.93 | 90.16,65.65 D6.C 88.95,65.63 v88.93,65.65
  Bottom 0.254: v73.25,57.93 73.51,57.68 73.51,57.63 74.27,56.87 84.05,56.87 89.13,61.95 89.13,63.16 88.33,63.96 88.33,65.06 v88.93,65.65
N$75  (via drill 0.35)
  Top 0.254: U4.25 74.16,63.03 v74.16,57.91 | v88.97,67 90.16,67 D7.C
  Bottom 0.254: v74.16,57.91 v74.17,57.91 74.8,57.28 83.88,57.28 88.64,62.03 88.72,62.11 88.72,63 87.76,63.96 87.76,65.86 88.9,67 v88.97,67 88.72,66.75
N$76  (via drill 0.35)
  Top 0.254: U4.26 74.75,58.25 v75.07,57.94 | v89.03,68.42 D8.C
  Bottom 0.254: v75.07,57.94 75.32,58.19 84.22,58.19 88.31,62.28 88.31,62.83 87.93,63.21 87.91,63.21 87.35,63.77 87.35,66.04 87.38,66.06 87.38,66.77 v89.03,68.42
N$77  (via drill 0.35)
  Top 0.254: U4.27 75.24,62.15 v75.97,61.41 | v88.98,69.77 89,69.79 D9.C
  Bottom 0.254: v75.97,61.41 78.64,61.41 86.74,69.51 88.72,69.51 v88.98,69.77
N$78  (via drill 0.35)
  Top 0.152: v88.88,58.14 87.94,57.2 R50.2
  Bottom 0.152: D5.A 91.94,61.2 v88.88,58.14
  other vias: 91.94,64.16
N$79  (via drill 0.35)
  Top 0.152: v88.9,59.96 88.14,59.2 R51.2
  Bottom 0.152: v88.9,59.96 88.9,60.64 89.89,61.63 89.89,63.58 D6.A
  other vias: 91.94,65.63
N$80
  Top 0.152: D7.A 91.94,66.86 91.21,66.14 91.21,63.65 91.83,63.02 R52.2
N$81
  Top 0.152: D8.A 91.96,68.24 92.71,67.49 92.71,59.34 R53.2
N$82
  Top 0.152: D9.A 93.02,68.74 93.02,57.92 R54.2
P11A  (via drill 0.35)
  Top 0.406: U$5.3 50.34,55.6 v50.32,55.62
  Bottom 0.254: J6.9 52.91,65.1 51.69,66.32 51.69,67.33 52.91,68.55 J6.5
  Bottom 0.406: v50.32,55.62 47.83,58.11 47.83,63.32 48.8,64.28 J6.9
P22
  Top 0.254: U4.22 72.75,59.35 71.6,58.21 68.47,58.21 67.61,57.35 64.92,57.35 J6.8
P22A  (via drill 0.35)
  Top 0.254: J6.11 52.91,62.56 51.69,63.78 51.69,64.79 52.91,66.01 J6.7
  Top 0.406: D4.C 47.03,58.11 R44.1 47.18,58.8 48.03,57.94
  Top 0.508: R44.1 47.03,61.4 v48.56,62.94
  Bottom 0.508: v48.56,62.94 51.72,62.94 J6.11
PD_ALM  (via drill 0.35)
  Top 0.254: U3.23 35.49,77.99 v37.06,76.42 37.09,76.4 | J4.4 44.6,77.09 44.6,76.37 45.28,75.69 51.86,75.69 52.24,76.07 56.12,76.07 57.33,74.86 v57.33,74.43 | v86.06,64.28 86.06,65.48 | 86.06,65.48 86.06,65.58 | 86.06,65.48 84.46,67.08 U4.37
  Bottom 0.254: J4.4 40.39,78 39.4,78 37.83,76.42 v37.06,76.42 | v57.33,74.43 58.51,73.24 58.51,72.69 58.27,72.45 58.27,60.38 59.24,59.41 59.46,59.41 | 59.46,59.41 | v86.06,64.28 86.01,64.28 81.84,60.12 64.91,60.12 64.89,60.09 64.35,60.09 64.32,60.12 60.61,60.12 59.9,59.41 59.46,59.41
RA
  Top 0.254: SIGNAL-CONN.1 R10.1
RL  (via drill 0.35)
  Top 0.254: v8.55,42.82 11.32,42.82 R13.1
  Bottom 0.254: SIGNAL-CONN.6 7.72,42.82 v8.55,42.82
RLDIN  (via drill 0.35 pad 0.55)
  Top 0.254: IC1.11 21.88,41.97 20.9,40.98 20.9,39.55 21.73,38.72 | 21.73,38.72 22.36,38.09 R15.1 23.51,38.09 | v35.22,38.09 26.4,38.09 25.62,38.87 24.5,38.87 23.51,39.86 22.86,39.86 21.73,38.72
  Bottom 0.254: v35.22,38.09 38.24,35.07 38.24,32.06 39.98,30.31 TEST-CONN.5
RLDINIV  (via drill 0.35 pad 0.55)
  Top 0.254: IC1.10 21.38,42.04 R9.1 19.78,37.39 | R8.1 16.64,37.45 17.45,36.64 19.03,36.64 19.78,37.39 | 19.78,37.39 C12.2 22.48,37.42 22.59,37.31 30.76,37.31 30.93,37.14 v35.22,37.14 | v36.49,32.85 TEST-CONN.4
  Bottom 0.254: v35.22,37.14 35.22,34.12 v36.49,32.85
RLDOUT  (via drill 0.35 pad 0.55)
  Top 0.254: C12.1 18.11,40.41 | 18.11,40.41 R9.2 | IC1.9 20.79,42.74 20.79,42.42 20.27,41.9 v19.5,41.9 18.11,40.51 18.11,40.41 | TEST-CONN.3 42.05,36.21 43.26,37.42 43.26,38.44 42.55,39.15 31.3,39.15 v29.5,41.1
  Bottom 0.254: v19.5,41.9 21.91,41.9 22.25,42.24 28.37,42.24 v29.5,41.1
RSTBCON  (via drill 0.35, 0.35 pad 0.55)
  Top 0.254: IC1.25 21.88,48.81 22,48.92 22,49.52 22.31,49.84 v22.36,49.84 | v23.42,57.37 25.83,59.79 25.83,62.02 27.59,63.77 41.2,63.77 COMM-CONN.1 | v42.24,67 47.78,67 v48.11,67.33
  Bottom 0.254: R2.1 22.86,51.88 | 22.86,51.88 22.36,51.38 v22.36,49.84 | 22.86,51.88 22.86,56.8 v23.42,57.37 | v48.11,67.33 48.11,85.85 48.03,85.92 49.28,87.17 52.88,87.17 55.97,90.25 S1.3
  Bottom 0.305: COMM-CONN.1 42.05,66.8 v42.24,67
RTS  (via drill 0.35)
  Top 0.254: U$5.14 58.52,55.6 v58.55,55.62
  Bottom 0.254: v58.55,55.62 54.13,60.04 54.13,69.87 52.91,71.09 J6.3
RX_ANA_SUP  (via drill 0.35)
  Top 0.152: U3.33 33.1,81.84 32.81,81.54 30.24,81.54 30.1,81.68 U3.39
  Top 0.254: U3.39 30.1,83.3 28.35,85.06 v27.84,85.06 26.46,85.06 C30.1
  Top 1.016: R28.2 83.4,28.91 81.54,30.78 54.89,30.78 J5.1
  Bottom 0.254: D2.5 21.26,85.24 | 21.26,85.24 21.26,84.88 | 21.26,84.88 D2.2 | v27.84,85.06 21.44,85.06 | 21.44,85.06 21.26,84.88 | 21.44,85.06 21.26,85.24
  Bottom 0.508: v27.84,85.06 27.84,86.63 24.08,90.39 24.08,94.41 25.83,96.16
  Bottom 0.61: 25.83,96.16 30.71,96.16 36.53,96.16 41.12,91.56 44.6,91.56 45.42,90.74 45.42,86.58
  Bottom 1.27: J5.1 52.48,32.13 52.48,38.65 52.15,38.98 48.59,38.98 45.42,42.15 45.42,74.39 45.42,86.58
RX_DIG_SUP  (via drill 0.35)
  Top 0.254: U3.31 34.11,82.98 34.68,83.54 36.54,83.54 | C29.1 37.32,84.32 36.54,83.54 | R37.1 39.59,80.7 v39.58,81.1 | v36.32,82.39 36.32,83.32 36.54,83.54
  Top 1.016: J5.2 81.18,32.79 84.61,29.36 84.61,26.48 83.43,25.29 R27.2
  Bottom 0.254: v39.58,81.1 38.28,82.39 v36.32,82.39
  Bottom 1.016: v39.58,81.1 39.58,80.41 36.02,76.85 36.02,75.99 37.49,74.52 37.49,53.67 40.45,50.72 39.5,49.77 34.18,44.45 34.18,33.69 39.22,28.65 55.02,28.65 55.96,29.58 55.96,30.91 54.36,32.51 J5.2
RX_SUP
  Top 0.813: 3V3-POWER-TESTPOINT2.1 66.22,28.57 C22.A 70.02,28.52 L4.1 L3.1
SCLK  (via drill 0.35)
  Top 0.254: IC1.17 28.25,44.73 28.77,44.21 34.55,44.21 34.8,44.46 v35.65,44.46 | U3.24 35.65,78.49 36.71,77.44 37.95,77.44 38.28,77.11 v38.28,75.23 | v41.31,68.14 41.44,68.27 42.55,68.27 43.11,68.83 v48.77,68.83 | v80.06,74.7 82.84,74.7 R49.2
  Bottom 0.254: v38.28,75.23 38.28,69.31 | 38.28,69.31 38.28,54 COMM-CONN.6 41.07,50.23 35.65,44.81 v35.65,44.46 | 38.28,69.31 40.14,69.31 v41.31,68.14 | v48.77,68.83 49.76,69.82 49.76,71.3 49.28,71.78 49.28,73.63 50.88,75.23 50.88,75.28 52.14,76.55 61.62,76.55 63.48,74.69 63.48,73.41 64.32,72.56 77.8,72.56 79.94,74.7 v80.06,74.7
SS  (via drill 0.35)
  Top 0.254: IC1.16 28.17,44.23 28.6,43.8 36.28,43.8 v36.53,44.05 | v40.57,52.63 40.83,52.38 40.83,49.72 42.05,48.51 COMM-CONN.7 | v39.76,61.96 36.44,61.96 v36.3,62.1 | v13.83,91.16 14.79,92.12 22.64,92.12 26.86,96.34 34.19,96.34 38.74,91.79 40.17,91.79 45.82,86.14 45.82,80.74 47.63,78.94 56.29,78.94 59.46,75.76 59.44,75.74 v59.44,73.02 | v61.55,67.23 61.7,67.08 U4.12
  Bottom 0.254: v36.53,44.05 36.53,45.12 40.53,49.11 41.19,49.11 42.05,48.25 COMM-CONN.7 | v36.3,62.1 35.64,62.1 35.28,62.45 28.4,62.45 26.85,60.9 20.85,60.9 16.65,56.71 6.89,56.71 | v40.57,52.63 40.57,53.02 41.23,53.68 41.23,54.4 40.83,54.8 40.83,58.49 40.39,58.93 40.39,61.33 v39.76,61.96 | 6.89,56.71 6.83,56.66 | 6.89,56.71 6.59,56.71 4.04,59.26 4.04,83.81 8.5,88.26 10.93,88.26 v13.83,91.16 | v59.44,73.02 59.44,69.33 v61.55,67.23
STE  (via drill 0.35)
  Top 0.254: U3.27 34.91,79.91 35.96,79.91 37.21,78.66 39.29,78.66 40.33,77.61 40.33,75.84 v43.54,75.84 44.25,75.13 44.69,75.13 44.94,74.87 50.75,74.87 52.41,73.22 53.31,73.22 54.23,72.31 54.23,71.4 55.45,70.18 J6.6 58.24,66.57 U4.13 | v44.05,85.03 44.05,85.27 J4.1
  Bottom 0.254: v43.54,75.84 43.54,81.31 43.72,81.5 43.72,84.71 v44.05,85.03
TCK  (via drill 0.35)
  Top 0.254: J6.2 57.48,72.41 57.48,72.31 61.29,72.31 63.07,74.09 63.07,77.29 63.75,77.97 66.5,77.97 v66.97,78.44 | v71.78,78.46 72.54,77.7 73.85,77.7 74.23,77.31 74.25,77.31 74.25,76.42 73.74,75.92 U4.57
  Bottom 0.254: v66.97,78.44 71.76,78.44 v71.78,78.46
TX_CTRL_SUP  (via drill 0.35)
  Top 0.254: U3.11 29.6,74.04 C25.1 28.59,74.02 v28.58,74.01
  Top 1.016: R21.2 88.84,11.55 89.84,12.56 89.84,27.43 79.41,37.87 J5.4 44.81,47.41 44.81,64.08 43.16,65.73 36.48,65.73 v33.43,68.78 33.38,68.83
  Bottom 0.508: v28.58,74.01 31.19,71.39 32.36,71.39 33.43,70.33 v33.43,68.78
URXD0  (via drill 0.35)
  Top 0.254: J6.12 59.38,61.74 64.59,56.54 67.39,56.54 68.3,56.54 | U4.33 81.84,65.07 83.62,63.29 83.62,61.97 78.18,56.54 68.3,56.54 | 68.3,56.54 v68.91,57.15
  Bottom 0.254: v68.91,57.15 70.26,57.15 71.76,55.65 85.3,55.65 89.59,51.36 89.59,50.21 90.81,48.99 J7.3
UTXD0  (via drill 0.35)
  Top 0.254: J6.10 57.42,64.28 64.76,56.94 67.78,56.94 68.64,57.81 69.85,57.81 | U4.32 77.75,59.69 75.32,57.25 72.1,57.25 71.54,57.81 69.85,57.81 | 69.85,57.81 70.46,57.19 v71.15,57.19
  Bottom 0.254: v71.15,57.19 72.49,57.19 73.62,56.06 85.47,56.06 J7.2
V1
  Top 0.254: SIGNAL-CONN.4 5.25,42.69 7.98,39.96 11.25,39.96 R14.1
VCM_SHIELD  (via drill 0.35)
  Top 0.254: R29.1 23.92,79.93 23.07,79.93 v22.58,79.45 | v22.58,79.45 22.56,79.42 | v22.4,83.33 23.24,82.49 C27.1 | v22.58,79.45 22.28,79.14 20.35,79.14 20.17,78.96 20.17,78.84 19.78,78.46 19.24,78.46 19.04,78.66 18.72,78.66 16.33,76.27 12.37,76.27 | v22.4,83.33 20.5,83.33 19.89,83.94 19.21,83.94 18.83,83.55 18.83,83.08 18.64,82.9 18.64,81.76 15.37,78.48 12.57,78.48 | v22.4,83.33 22.68,83.61 22.68,86.86 22.1,87.45 19.15,87.45 17.27,85.57 17.27,82.16
  Bottom 0.254: v22.58,79.45 22.4,79.62 v22.4,83.33
WCT  (via drill 0.35 pad 0.55)
  Top 0.254: IC1.7 18,43.73 v17.92,43.65 | v31.73,39.84 32.36,40.47 TEST-CONN.1
  Bottom 0.254: v17.92,43.65 16.96,42.69 16.96,42.22 21.25,37.93 30.62,37.93 31.73,39.04 v31.73,39.84
XI
  Top 0.254: Y3.1 52.71,44.03 53.94,45.26 53.94,46.59 53.78,46.75 52.75,46.75 C37.1 52.08,47.45 50.72,48.81 50.72,49.68 50.89,49.84 51.09,49.84 U$5.7
XIN_MSP  (via drill 0.35)
  Top 0.254: U3.38 30.6,84.99 29.24,86.36 R34.1 30.52,86.93 v30.53,86.94 | J4.3 43.26,80.97 43.26,79.01 45.01,77.26 45.01,76.53 45.45,76.09 51.69,76.09 52.07,76.47 56.29,76.47 57.73,75.03 57.73,74.95 v58.78,73.9 | v64.34,61.66 64.59,61.41 64.89,61.41 64.97,61.34 71.07,61.34 71.73,62 U4.20
  Bottom 0.254: v30.53,86.94 31.42,86.05 31.42,84.99 31.81,84.61 32.35,84.61 32.43,84.68 40.11,84.68 42.05,82.74 J4.3 | v58.78,73.9 59,73.68 59.71,73.68 63.63,69.76 63.63,62.37 v64.34,61.66
XO
  Top 0.254: Y3.3 56.38,45.96 C36.1 53.47,47.44 52.94,47.98 52.94,48.64 52.33,49.25 U$5.8
XOUT
  Top 0.305: Y4.P$1 60.6,68.14 61.04,68.58 U4.9
XT2OUT
  Top 0.305: Y5.1 76.11,88.87 76.11,87.15 77.28,85.97 C41.2 76.25,84.33 U4.52

## Text on the board
tPlace: RST_ADS | RST_AFE | STE | CLKOUT | XIN_MSP | PD_ALM | ADC_RDY | LED_ALM | DIAG_END | AFE_PDN | RST | 4.096mHZ | CLK | DRD | MISO | MOSI | SCLK | CS | ALRM | WCT | GND_AFE | CMO | TX_DRV_SUP | RLDO | LED_DRV_SUP | PLDI | RX_DIG_SUP | RLDI | RX_ANA_SUP | GND | 3V3 | 5V | 5V TESTP | 3V3 TESTP | POWER-SEL | 2017-05-28
tNames: AFE MODULE | 8MHz | IC2 | AFE4400 | AFE-CONN | ADS MODULE | ECG-PPG Measurement | Main PCB | IC1 | COMM-CONN | BT CONN | ADS-1293 | ECG LEADS CONN | By Jingjie Li, XJTU-BME | AFE_PWR | TESTP-CONN | LM1117 | POWER-CONN | U1 | LDO MODULE | LDO MODULE